# Altium project ProjectLOOM_2.PrjPcb
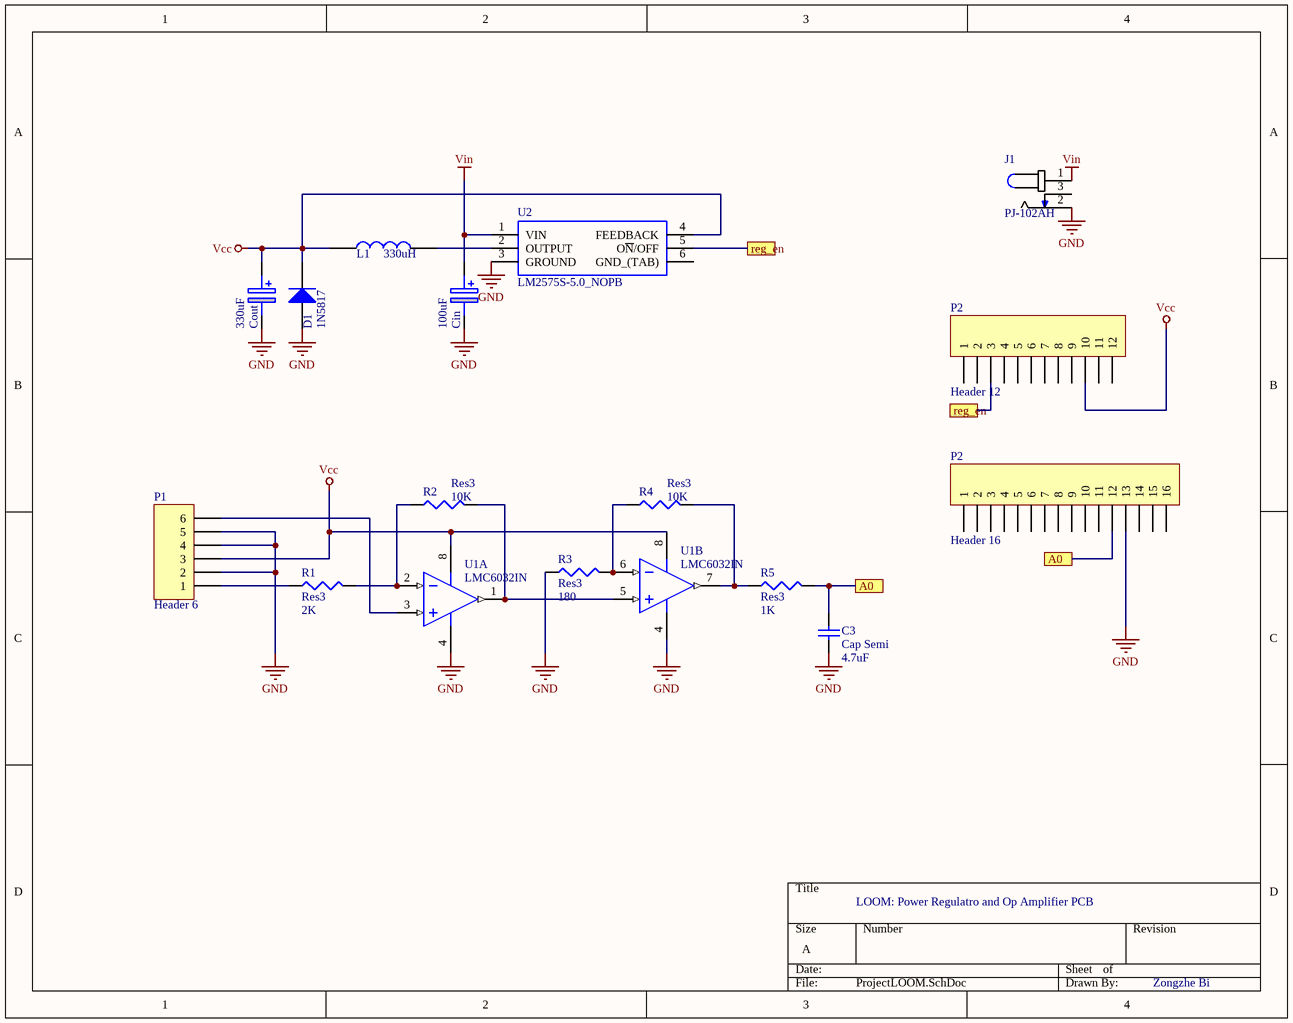
[diagram p0: ProjectLOOM.SchDoc]
1 sheet, 16 parts. Net scope: flat (ports and power ports of the same name join across sheets).
Board file: ProjectLOOM.PcbDoc

## Sheet ProjectLOOM.SchDoc
size A

### Parts
(Parts that share a designator on the sheet are numbered #1, #2 ... from top to bottom, then left to right.)
C3  Cap Semi  value 4.7uF  [C1206]
Cin  100uF  [CAPAE660X800N]
Cout  330uF  [CAPAE660X800N]
D1  1N5817  [DO-41]
J1  PJ-102AH  [CUI_PJ-102AH]
L1  330uH  [INDPM120120X805N]
P1  Header 6  [HDR1X6]
P2#1  Header 12  [HDR1X12]
P2#2  Header 16  [HDR1X16]
R1  Res3  value 2K  [J1-0603]
R2  Res3  value 10K  [J1-0603]
R3  Res3  value 180  [J1-0603]
R4  Res3  value 10K  [J1-0603]
R5  Res3  value 1K  [J1-0603]
U1  LMC6032IN  [N08E]  (parts A,B of 2)
U2  LM2575S-5.0_NOPB  [TO170P1435X465-6N]

### Ports
A0, reg_en

### Nets
GND: C3.1 Cin.2(+) Cout.2(+) D1.1(A) J1.2 P1.2 P1.4 P1.5 P2#2.13 R3.1 U1.4(V-) U2.3(GROUND)
Vcc: Cout.1(-) D1.2(K) L1.1 P1.3 P2#1.10 U1.8(V+) U2.4(FEEDBACK)
Vin: Cin.1(-) J1.1 U2.1(VIN)
NetC3_2: C3.2 P2#2.12 R5.2 ; port A0
NetL1_2: L1.2 U2.2(OUTPUT)
NetP1_1: P1.1 R1.1
NetP1_6: P1.6 U1.3(INA+)
NetP2#1_3: P2#1.3 U2.5(O~{N}/OFF) ; port reg_en
NetR1_2: R1.2 R2.1 U1.2(INA-)
NetR2_2: R2.2 U1.1(OUTA) U1.5(INB+)
NetR3_2: R3.2 R4.1 U1.6(INB-)
NetR4_2: R4.2 R5.1 U1.7(OUTB)

Not connected (* = marked no-connect by the designer): J1 3; P2#1 1 2 4 5 6 7 8 9 11 12; P2#2 1 2 3 4 5 6 7 8 9 10 11 14 15 16; U2 6(GND_(TAB))

### Notes on the sheet
- LOOM: Power Regulatro and Op Amplifier PCB
- Zongzhe Bi

### Library data of the parts
C3 = Cap Semi: Capacitor (Semiconductor SIM Model); Published: 8-Jun-2000; LatestRevisionDate: 29-May-2009; LatestRevisionNote: IPC-7351 Footprint Added.; PackageReference: C1206; Publisher: Altium Limited; PackageDescription: Chip Capacitor
Cin Cout = EEH-ZC1E101XV: Aluminum Organic Polymer Capacitors 25VDC 100uF 125degC VibeProof AEC-Q200; Manufacturer_Name: Panasonic; Geometry.Height: 8mm; Manufacturer_Part_Number: EEH-ZC1E101XV; RS Part Number: *; RS Price/Stock: *; Mouser Part Number: 667-EEH-ZC1E101XV; Mouser Price/Stock: https://www.mouser.com/Search/Refine.aspx?Keyword=667-EEH-ZC1E101XV; Datasheet Link: https://industrial.panasonic.com/cdbs/www-data/pdf/RDD0000/ABA0000C1234.pdf
D1 = Diode 1N4001: 1 Amp General Purpose Rectifier; Published: 8-Jun-2000; LatestRevisionDate: 17-Jul-2002; LatestRevisionNote: Re-released for DXP Platform.; DatasheetVersion: 1998; PackageVersion: Aug-1999; PackageReference: DO-41; Publisher: Altium Limited; PackageDescription: Diode, Axial; Body 5.2 x 2.7 mm (LxDia. max), Lead Dia. 0.86 mm (max); Code_JEDEC: DO-204-AL; ComponentLink1Description: Manufacturer Link; ComponentLink1URL: http://www.fairchildsemi.com/; ComponentLink2Description: Datasheet; ComponentLink2URL: http://www.fairchildsemi.com/ds/1N%2F1N4001.pdf
J1 = PJ-102AH: 2.0 mm Center Pin, 5.0 A, Right Angle, Through Hole, Tapered Pins, Dc Power Jack Connector; MF: CUI Inc.; Price: None; Availability: Unavailable; Package: None; SnapEDA_Link: https://www.snapeda.com/parts/PJ-102AH/CUI%20Inc./view-part/?ref=snap; MP: PJ-102AH; CUI_purchase_URL: https://www.cui.com/product/interconnect/dc-power-connectors/jacks/2.0-mm-center-pin/pj-102ah?utm_source=snapeda.com&utm_medium=referral&utm_campaign=snapedaBOM; Value: *
L1 = MSS1278T-334KLD: COILCRAFT - MSS1278T-334KLD - INDUCTOR, 330UH, 1A, 10%,2.9MHZ, REEL; Geometry.Height: 8.05mm; Mouser Part Number: 994-MSS1278T-334KLD; Manufacturer_Name: COILCRAFT; Manufacturer_Part_Number: MSS1278T-334KLD; Datasheet Link: https://componentsearchengine.com/Datasheets/1/MSS1278T-334KLD.pdf
P1 = Header 6: Header, 6-Pin; LatestRevisionDate: 17-Jul-2002; LatestRevisionNote: Re-released for DXP Platform.; Publisher: Altium Limited
P2#1 = Header 12: Header, 12-Pin; LatestRevisionDate: 17-Jul-2002; LatestRevisionNote: Re-released for DXP Platform.; Publisher: Altium Limited
P2#2 = Header 16: Header, 16-Pin; LatestRevisionDate: 17-Jul-2002; LatestRevisionNote: Re-released for DXP Platform.; Publisher: Altium Limited
R1-R5 = Res3: Resistor; Published: 8-Jun-2000; LatestRevisionDate: 29-May-2009; LatestRevisionNote: IPC-7351 Footprint Added.; PackageReference: J1-0603; Publisher: Altium Limited; PackageDescription: Chip Resistor
U1 = LMC6032IN: CMOS Dual Operational Amplifier, 8-pin MDIP; Manufacturer: National Semiconductor; PackageTopMarking: NSUZXYTTE#*LMC*6032IN; PowerWise: N; CompType: Amplifiers; High-Reliability: Y; DatasheetVersion: Aug-2000; PackageVersion: revG, May-2006; PackageReference: N08E; PackageDescription: MDIP, .365 x .250 x .130in, 8 Lead, .100in Pitch; PartNumber: LMC6032IN; RoHS: N; PinCount: 8; Code_JEDEC: MS-001-BA; ComponentLink1Description: Manufacturer URL; ComponentLink1URL: http://www.national.com/; ComponentLink2Description: LMC6032 Datasheet; ComponentLink2URL: http://www.national.com/ds/LM/LMC6032.pdf; ComponentLink3Description: LMC6032 Web Page; ComponentLink3URL: http://www.national.com/pf/LM/LMC6032.html; ComponentLink4Description: N08E Package Page; ComponentLink4URL: http://www.national.com/packaging/folders/n08e.html
U2 = LM2575S-5.0_NOPB: SIMPLE SWITCHER 1A Step-Down Voltage Regulator; Manufacturer_Name: Texas Instruments; Manufacturer_Part_Number: LM2575S-5.0/NOPB; Geometry.Height: 4.65mm; Mouser Part Number: 926-LM2575S-5.0/NOPB; Datasheet Link: *